# EAGLE design pceigr_v0.7 (EAGLE 9.6.2)
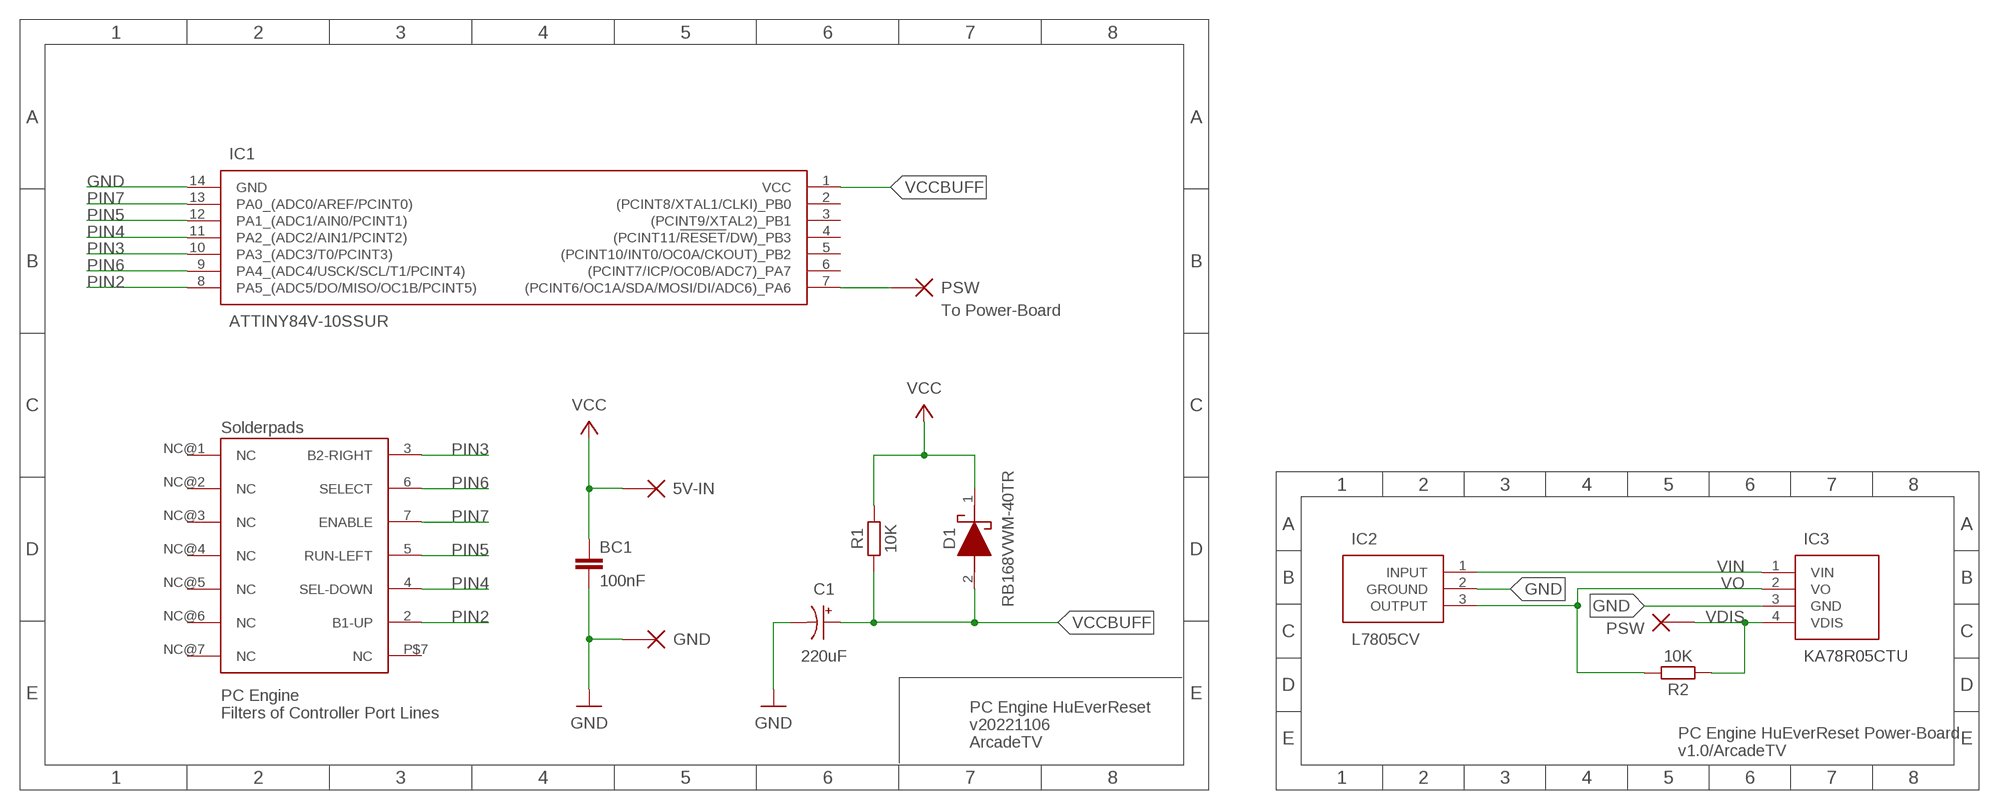
[diagram p0: schematic, sheet 1]

## Parts
BC1  100nF  C0805  [Z0805]
C1  220uF  CPOL-USC/6032-28R  [C/6032-28R]
D1  RB168VWM-40TR  [RB168VWM40TR]
IC1  ATTINY84V-10SSUR  [SOIC127P600X175-14N]
IC2  L7805CV  [TO255P460X1020X2008-3P]
IC3  KA78R05CTU  KA78R05CTUVERTICALMOUNT  [PADS]
P1  5V-IN  PAD  [PADS]
P2  GND  PAD  [PADS]
P3  PSW  PAD  [PADS]
R1  10K  R0805  [Z0805]
R2  10K  R0805  [Z0805]
U$1  PCE-CNTRL-FILTERS  [PCE-CNTRL-FILTERS]
U$2  PSW  PAD  [PADS]

## Nets
GND: BC1.2 C1.- IC1.14(GND) IC2.2(GROUND) IC3.3(GND) P2.P$1
PIN2: IC1.8(PA5_(ADC5/DO/MISO/OC1B/PCINT5)) U$1.2(B1-UP)
PIN3: IC1.10(PA3_(ADC3/T0/PCINT3)) U$1.3(B2-RIGHT)
PIN4: IC1.11(PA2_(ADC2/AIN1/PCINT2)) U$1.4(SEL-DOWN)
PIN5: IC1.12(PA1_(ADC1/AIN0/PCINT1)) U$1.5(RUN-LEFT)
PIN6: IC1.9(PA4_(ADC4/USCK/SCL/T1/PCINT4)) U$1.6(SELECT)
PIN7: IC1.13(PA0_(ADC0/AREF/PCINT0)) U$1.7(ENABLE)
PSWITCH: IC1.7((PCINT6/OC1A/SDA/MOSI/DI/ADC6)_PA6) P3.P$1
VCC: BC1.1 D1.1(K) P1.P$1 R1.2
VCCBUFF: C1.+ D1.2(A) IC1.1(VCC) R1.1
VDIS: IC3.4(VDIS) R2.1 U$2.P$1
VIN: IC2.1(INPUT) IC3.1(VIN)
VO: IC2.3(OUTPUT) IC3.2(VO) R2.2
Unconnected: IC1.2((PCINT8/XTAL1/CLKI)_PB0) IC1.3((PCINT9/XTAL2)_PB1) IC1.4((PCINT11/!RESET!/DW)_PB3) IC1.5((PCINT10/INT0/OC0A/CKOUT)_PB2) IC1.6((PCINT7/ICP/OC0B/ADC7)_PA7) U$1.NC@1(NC) U$1.NC@2(NC) U$1.NC@3(NC) U$1.NC@4(NC) U$1.NC@5(NC) U$1.NC@6(NC) U$1.NC@7(NC) U$1.P$7(NC)

## Notes on the sheet
- To Power-Board
- Solderpads
- PC Engine
  Filters of Controller Port Lines
- PC Engine HuEverReset
  v20221106
  ArcadeTV
- PC Engine HuEverReset Power-Board
  v1.0/ArcadeTV

## Library data of the parts
BC1 = arcadetv:C0805
C1 = rcl:CPOL-US: POLARIZED CAPACITOR, American symbol; SPICEPREFIX: C
D1 = RB168VWM-40TR:RB168VWM-40TR: Schottky Barrier Diode40V, 1A, Single, PMDE, Ultra low IR SBD IFSM:30 A Source: Datasheet <https://fscdn.rohm.com/en/products/databook/datasheet/discrete/diode/schottky_barrier/rb168vwm-40tr-e.pdf>; DESCRIPTION: Schottky Barrier Diode40V, 1A, Single, PMDE, Ultra low I<sub>R</sub> SBD IFSM:30 A; HEIGHT: 1mm; MANUFACTURER_NAME: ROHM Semiconductor; MANUFACTURER_PART_NUMBER: RB168VWM-40TR
IC1 = ATTINY84V-10SSUR:ATTINY84V-10SSUR: MCU 8-bit AVR RISC 8KB Flash 2.5V/3.3V/5V 14-Pin SOIC W T/R Source: Datasheet <http://www.microchip.com/mymicrochip/filehandler.aspx?ddocname=en590735>; DESCRIPTION: MCU 8-bit AVR RISC 8KB Flash 2.5V/3.3V/5V 14-Pin SOIC W T/R; HEIGHT: 1.75mm; MANUFACTURER_NAME: Microchip; MANUFACTURER_PART_NUMBER: ATTINY84V-10SSUR; MOUSER_PART_NUMBER: 556-ATTINY84V-10SSUR; MOUSER_PRICE-STOCK: https://www.mouser.co.uk/ProductDetail/Microchip-Technology-Atmel/ATTINY84V-10SSUR?qs=6Dg1WZIWLC7huvQLwg3cTw%3D%3D
IC2 = L7805CV:L7805CV: Linear voltage regulator,L7805CV 5V 1.5A STMicroelectronics L7805CV, Single Linear Voltage Regulator, 1.5A 5 V, 3-Pin TO-220 Source: Datasheet <http://www.st.com/web/en/resource/technical/document/datasheet/CD00000444.pdf>; DESCRIPTION: Linear voltage regulator,L7805CV 5V 1.5A STMicroelectronics L7805CV, Single Linear Voltage Regulator, 1.5A 5 V, 3-Pin TO-220; HEIGHT: 4.6mm; MANUFACTURER_NAME: STMicroelectronics; MANUFACTURER_PART_NUMBER: L7805CV; MOUSER_PART_NUMBER: 511-L7805CV; MOUSER_PRICE-STOCK: https://www.mouser.co.uk/ProductDetail/STMicroelectronics/L7805CV?qs=9NrABl3fj%2FqplZAHiYUxWg%3D%3D
IC3 = KA78R05CTU:KA78R05CTU: LDO Voltage Regulator 5V 1A 4 Pin TO220F Source: Datasheet <https://datasheet.datasheetarchive.com/originals/distributors/Datasheets_SAMA/c9fffb4f2039f13a6ae1b6247a1bed7a.pdf>
P1-P3 U$2 = arcadetv:PAD
R1 R2 = arcadetv:R0805
U$1 = arcadetv:PCE-CNTRL-FILTERS

## Board
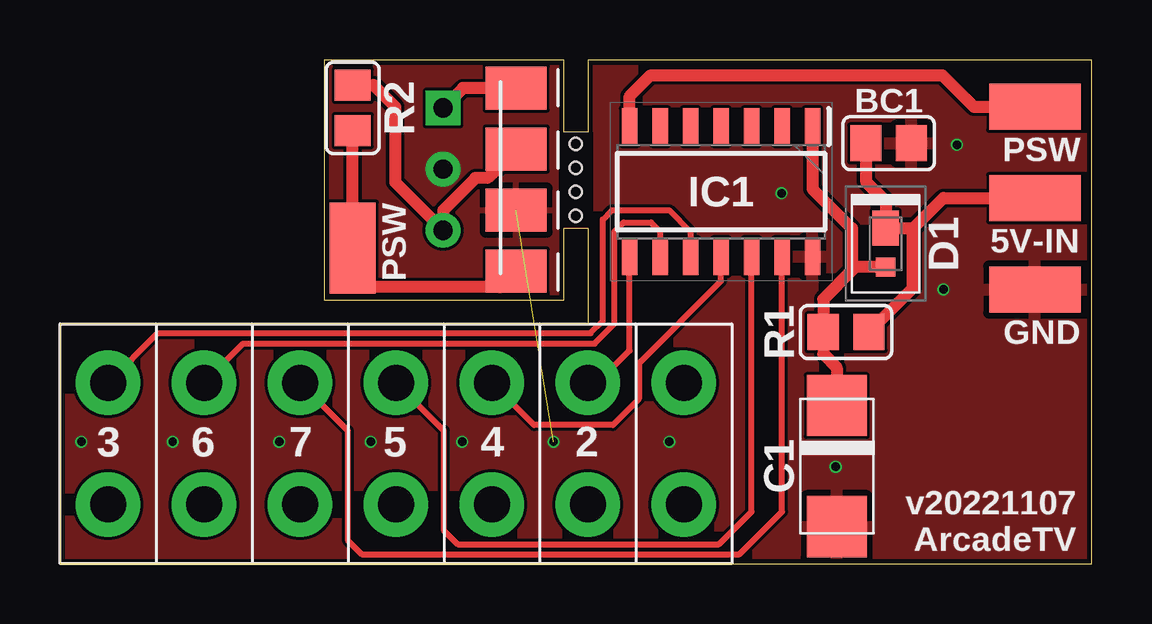
[diagram p1: board, top side]
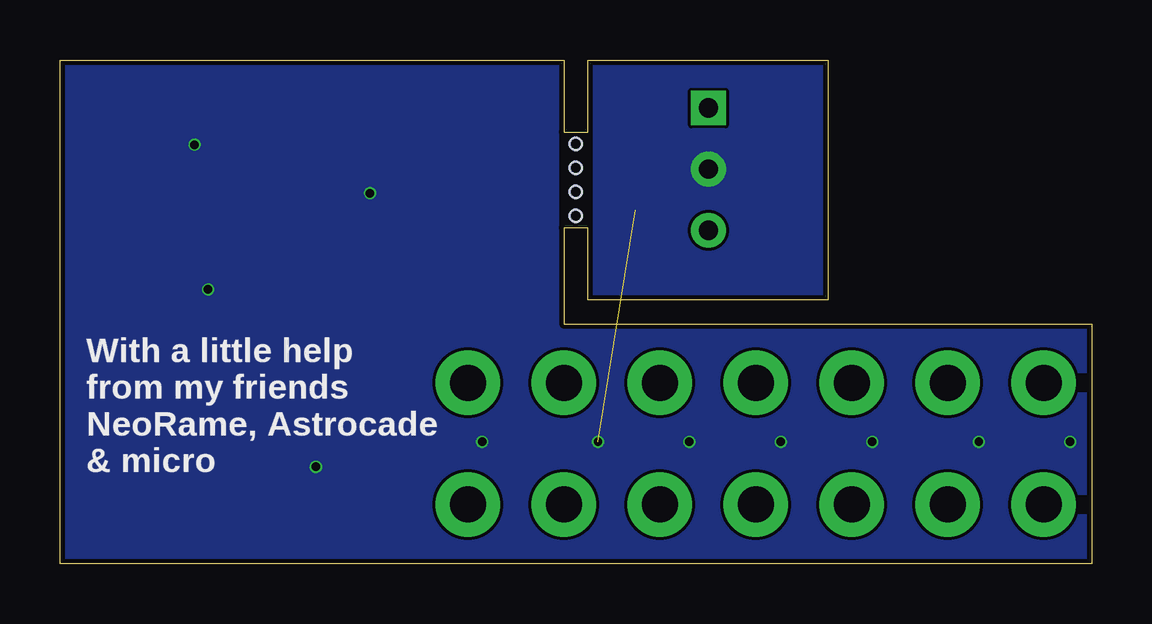
[diagram p2: board, bottom side, seen from below]

Size 43 x 21 mm. Coordinates in mm from the lower left corner, seen from the top.
Outline: 0,0 43,0 43,21 22,21 22,18 21,18 21,21 11,21 11,11 21,11 21,14 22,14 22,10 0,10 0,0
Copper layers (1*16): Top 0.035mm / dielectric 1.6mm / Bottom 0.035mm
Design rules "jlcpcb-2layers *": minimum track width 5mil, minimum drill 0.3mm, track to track 5mil, track to pad 5mil, pad to pad 5mil, via to via 5mil, smd to smd 5mil, copper to edge 0.2mm, drill to drill 6mil, minimum pad ring 10mil, minimum via ring 3mil, stop-mask expansion 4mil, vias tented up to drill 15mil, thermal gap 10mil
Holes 0.5 mm at 21.5,17.5 21.5,16.5 21.5,15.5 21.5,14.5

### Footprints (pad centres in the part's own frame; a part is rotated, then mirrored left to right if it is on the bottom)
Z0805 = smd 1.3 x 1.5: 1 -0.95,0; 2 0.95,0
C/6032-28R = smd 2.55 x 2.5: + 2.525,0; - -2.525,0
RB168VWM40TR = smd 1.1 x 1.45: 1 0,0.65 | smd 0.8 x 0.8: 2 0,-0.975
SOIC127P600X175-14N = smd 1.528 x 0.65: 1 -2.711,3.81; 2 -2.711,2.54; 3 -2.711,1.27; 4 -2.711,0; 5 -2.711,-1.27; 6 -2.711,-2.54; 7 -2.711,-3.81; 8 2.711,-3.81; 9 2.711,-2.54; 10 2.711,-1.27; 11 2.711,0; 12 2.711,1.27; 13 2.711,2.54; 14 2.711,3.81
TO255P460X1020X2008-3P = drill 0.8 square: 1 0,0 | drill 0.8: 2 2.55,0; 3 5.1,0
PADS = smd 1.8 x 2.54: 1 -3.175,0; 2 -0.635,0; 3 1.905,0; 4 4.445,0
PADS' = smd 1.93 x 3.81: P$1 0,0
PCE-CNTRL-FILTERS = drill 1.5: 2 8,2.54; 3 -12,2.54; 4 4,2.54; 5 0,2.54; 6 -8,2.54; 7 -4,2.54; NC@1 -12,-2.54; NC@2 -8,-2.54; NC@3 -4,-2.54; NC@4 0,-2.54; NC@5 4,-2.54; NC@6 8,-2.54; NC@7 12,-2.54; P$7 12,2.54

### Placement (x,y rotation side)
BC1  34.54,17.53 0 top
C1  32.38,4.06 90 top
D1  34.42,13.34 0 top
IC1  27.56,15.51 270 top
IC2  15.97,19 270 top
IC3  19.02,16.65 270 top
P1  5V-IN  [PADS']  40.64,15.24 90 top
P2  GND  [PADS']  40.64,11.43 90 top
P3  PSW  [PADS']  40.64,19.05 90 top
R1  32.77,9.65 0 top
R2  12.2,19 90 top
U$1  14,5 0 top
U$2  PSW  [PADS']  12.2,13.16 180 top

### Tracks (layer width: path | path; a pad name or v marks a point on that pad's centre or on a via)
GND  (via drill 0.35)  (1 unrouted)
  other vias: 30.08,15.44 32.33,4.04 36.83,11.43 25.4,5.08 20.57,5.08 16.76,5.08 12.95,5.08 9.14,5.08 4.7,5.08 0.89,5.08 37.39,17.47
  pour Top: 0,0 0,10 22,10 22,21 43,21 43,0
  pour Bottom (rank 3): 0,0 0,10 22,10 22,21 43,21 43,0
  pour Top: 10.97,11 20.97,11 20.97,21 10.97,21
  pour Bottom: 10.97,11 20.97,11 20.97,21 10.97,21
N$1
  cutout Top: 21,18 22,18 22,14 21,14
  cutout Bottom: 21,18 22,18 22,14 21,14
PIN2
  Top 0.254: U$1.2 22.4,7.54 23.75,8.88 IC1.8
PIN3
  Top 0.254: U$1.3 4.07,9.61 22.12,9.61 22.63,10.12 22.63,14.35 23.01,14.73 25.4,14.73 26.29,13.85 IC1.10
PIN4
  Top 0.254: U$1.4 19.77,5.78 23.05,5.78 24.13,6.86 24.13,8.35 27.56,11.78 IC1.11
PIN5
  Top 0.254: U$1.5 15.99,5.55 15.99,1.39 16.58,0.8 27.47,0.8 28.83,2.16 IC1.12
PIN6
  Top 0.254: U$1.6 7.63,9.17 22.28,9.17 23.11,10 23.11,13.84 23.5,14.22 24.64,14.22 25.02,13.84 IC1.9
PIN7
  Top 0.254: U$1.7 11.99,5.55 11.99,0.97 12.58,0.39 28.33,0.39 30.1,2.16 IC1.13
PSWITCH
  Top 0.508: IC1.7 23.75,19.49 24.62,20.36 36.79,20.36 38.1,19.05 P3.P$1
VCC
  Top 0.508: BC1.1 33.59,15.94 34.42,15.11 D1.1 35.58,13.98 | 35.58,13.98 36.83,15.24 P1.P$1 | R1.2 35.56,11.5 35.56,13.97 35.58,13.98
VCCBUFF
  Top 0.508: 33.02,12.23 31.82,11.03 R1.1 31.82,8.73 32.38,8.16 C1.+ | IC1.1 31.37,15.62 33.02,13.97 33.02,12.23 | D1.2 33.15,12.36 33.02,12.23
VDIS
  Top 0.508: IC3.4 18.34,11.53 12.2,11.53 U$2.P$1 R2.1 | R2.1
VIN
  Top 0.508: IC3.1 16.8,19.82 IC2.1
VO
  Top 0.508: IC3.2 17.82,16.08 17.32,16.08 15.97,14.73 IC2.3 13.97,15.9 13.97,19.05 13.07,19.95 R2.2

### Text on the board
tPlace: PSW | 5V-IN | 3 | 6 | 7 | 5 | 4 | 2 | v20221107 / ArcadeTV
bPlace: With a little help / from my friends / NeoRame, Astrocade / & micro
tStop: HuEverReset